# EAGLE design HeepTeensyBoard (EAGLE 7.3.0)
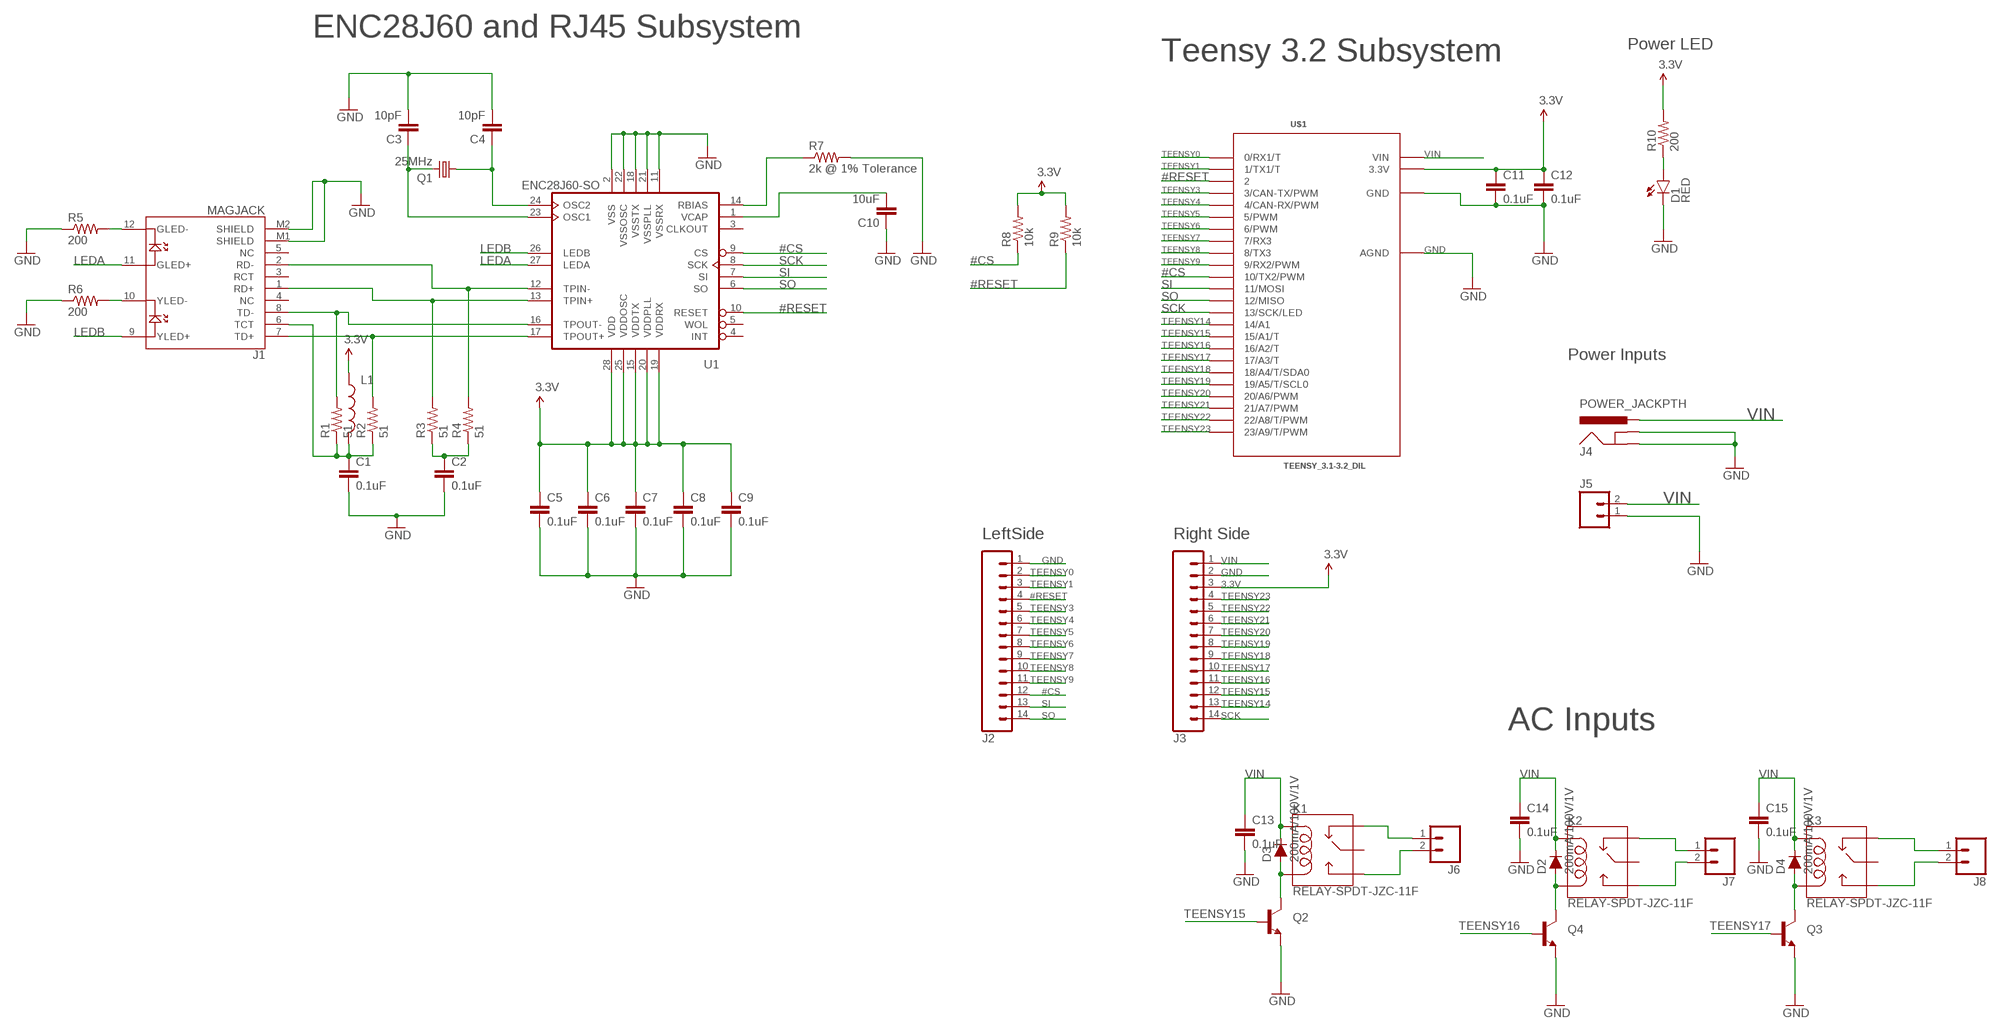
[diagram p0: schematic, sheet 1]

## Parts
C1  0.1uF  CAP0603-CAP  [0603-CAP]
C2  0.1uF  CAP0603-CAP  [0603-CAP]
C3  10pF  CAP0603-CAP  [0603-CAP]
C4  10pF  CAP0603-CAP  [0603-CAP]
C5  0.1uF  CAP0603-CAP  [0603-CAP]
C6  0.1uF  CAP0603-CAP  [0603-CAP]
C7  0.1uF  CAP0603-CAP  [0603-CAP]
C8  0.1uF  CAP0603-CAP  [0603-CAP]
C9  0.1uF  CAP0603-CAP  [0603-CAP]
C10  10uF  CAP0603-CAP  [0603-CAP]
C11  0.1uF  CAP0603-CAP  [0603-CAP]
C12  0.1uF  CAP0603-CAP  [0603-CAP]
C13  0.1uF  CAP0603-CAP  [0603-CAP]
C14  0.1uF  CAP0603-CAP  [0603-CAP]
C15  0.1uF  CAP0603-CAP  [0603-CAP]
D1  RED  LED-RED0603  [LED-0603]
D2  200mA/100V/1V  DIODE-1N4148  [DIODE-1N4148]
D3  200mA/100V/1V  DIODE-1N4148  [DIODE-1N4148]
D4  200mA/100V/1V  DIODE-1N4148  [DIODE-1N4148]
J1  MAGJACK  [MAGJACK]
J2  M14  [1X14]
J3  M14  [1X14]
J4  POWER_JACKPTH  [POWER_JACK_PTH]
J5  M02PTH  [1X02]
J6  M025MM  [SCREWTERMINAL-5MM-2]
J7  M025MM  [SCREWTERMINAL-5MM-2]
J8  M025MM  [SCREWTERMINAL-5MM-2]
K1  RELAY-SPDT-JZC-11F  [RELAY-JZC]
K2  RELAY-SPDT-JZC-11F  [RELAY-JZC]
K3  RELAY-SPDT-JZC-11F  [RELAY-JZC]
L1  INDUCTOR0603  [0603]
Q1  25MHz  CRYSTALSM49  [SM49]
Q2  TRANSISTOR_NPNSOT23-3  [SOT23-3]
Q3  TRANSISTOR_NPNSOT23-3  [SOT23-3]
Q4  TRANSISTOR_NPNSOT23-3  [SOT23-3]
R1  51  RESISTOR0603  [0603-RES]
R2  51  RESISTOR0603  [0603-RES]
R3  51  RESISTOR0603  [0603-RES]
R4  51  RESISTOR0603  [0603-RES]
R5  200  RESISTOR0603  [0603-RES]
R6  200  RESISTOR0603  [0603-RES]
R7  2k @ 1% Tolerance  RESISTOR0603-RES  [0603-RES]
R8  10k  RESISTOR0603-RES  [0603-RES]
R9  10k  RESISTOR0603-RES  [0603-RES]
R10  200  RESISTOR0603-RES  [0603-RES]
U1  ENC28J60-SO  [SO28W]
U$1  TEENSY_3.1-3.2_DIL  [TEENSY_3.0-3.2&LC_DIL]

## Nets
3.3V: C5.1 C6.1 C7.1 C8.1 C9.1 C11.1 C12.1 J3.3 L1.1 R8.2 R9.2 R10.2 U1.15(VDDTX) U1.19(VDDRX) U1.20(VDDPLL) U1.25(VDDOSC) U1.28(VDD) U$1.3.3V
#CS: J2.12 R8.1 U1.9(CS) U$1.10(10/TX2/PWM)
#RESET: J2.4 R9.1 U1.10(RESET) U$1.2
GND: C1.2 C2.2 C3.2 C4.2 C5.2 C6.2 C7.2 C8.2 C9.2 C10.1 C11.2 C12.2 C13.2 C14.2 C15.2 D1.C J1.M1(SHIELD) J1.M2(SHIELD) J2.1 J3.2 J4.GND J4.GNDBREAK J5.1 Q2.2(E) Q3.2(E) Q4.2(E) R5.1 R6.1 R7.2 U1.2(VSS) U1.11(VSSRX) U1.18(VSSTX) U1.21(VSSPLL) U1.22(VSSOSC) U$1.AGND U$1.GND
LEDA: J1.11(GLED+) U1.27(LEDA)
LEDB: J1.9(YLED+) U1.26(LEDB)
N$1: J1.1(RD+) R3.2 U1.13(TPIN+)
N$2: J1.2(RD-) R4.2 U1.12(TPIN-)
N$3: J1.8(TD-) R1.2 U1.16(TPOUT-)
N$4: J1.7(TD+) R2.2 U1.17(TPOUT+)
N$5: C2.1 R3.1 R4.1
N$6: J1.10(YLED-) R6.2
N$7: C1.1 J1.6(TCT) L1.2 R1.1 R2.1
N$8: D1.A R10.1
N$9: D3.A K1.1(COIL2) Q2.3(C)
N$10: J1.12(GLED-) R5.2
N$11: D2.A K2.1(COIL2) Q4.3(C)
N$12: C3.1 Q1.2 U1.23(OSC1)
N$13: C4.1 Q1.1 U1.24(OSC2)
N$14: D4.A K3.1(COIL2) Q3.3(C)
N$15: R7.1 U1.14(RBIAS)
N$16: J6.1 K1.2(NC)
N$17: C10.2 U1.1(VCAP)
N$18: J6.2 K1.3(NO)
N$19: J7.1 K2.2(NC)
N$20: J7.2 K2.3(NO)
N$21: J8.1 K3.2(NC)
N$22: J8.2 K3.3(NO)
SCK: J3.14 U1.8(SCK) U$1.13(13/SCK/LED)
SI: J2.13 U1.7(SI) U$1.11(11/MOSI)
SO: J2.14 U1.6(SO) U$1.12(12/MISO)
TEENSY0: J2.2 U$1.0(0/RX1/T)
TEENSY1: J2.3 U$1.1(1/TX1/T)
TEENSY3: J2.5 U$1.3(3/CAN-TX/PWM)
TEENSY4: J2.6 U$1.4(4/CAN-RX/PWM)
TEENSY5: J2.7 U$1.5(5/PWM)
TEENSY6: J2.8 U$1.6(6/PWM)
TEENSY7: J2.9 U$1.7(7/RX3)
TEENSY8: J2.10 U$1.8(8/TX3)
TEENSY9: J2.11 U$1.9(9/RX2/PWM)
TEENSY14: J3.13 U$1.14/A0(14/A1)
TEENSY15: J3.12 Q2.1(B) U$1.15/A1(15/A1/T)
TEENSY16: J3.11 Q4.1(B) U$1.16/A2(16/A2/T)
TEENSY17: J3.10 Q3.1(B) U$1.17/A3(17/A3/T)
TEENSY18: J3.9 U$1.18/A4(18/A4/T/SDA0)
TEENSY19: J3.8 U$1.19/A5(19/A5/T/SCL0)
TEENSY20: J3.7 U$1.20/A6(20/A6/PWM)
TEENSY21: J3.6 U$1.21/A7(21/A7/PWM)
TEENSY22: J3.5 U$1.22/A8(22/A8/T/PWM)
TEENSY23: J3.4 U$1.23/A9(23/A9/T/PWM)
VIN: C13.1 C14.1 C15.1 D2.C D3.C D4.C J3.1 J4.PWR J5.2 K1.5(COIL1) K2.5(COIL1) K3.5(COIL1) U$1.VIN
Unconnected: J1.3(RCT) J1.4(NC) J1.5(NC) K1.4(MAIN) K2.4(MAIN) K3.4(MAIN) U1.3(CLKOUT) U1.4(INT) U1.5(WOL)

## Notes on the sheet
- ENC28J60 and RJ45 Subsystem
- Power LED
- Teensy 3.2 Subsystem
- Power Inputs
- LeftSide | Right Side
- AC Inputs

## Library data of the parts
C1 C2 C5-C9 C11-C15 = SparkFun-Capacitors:CAP: Capacitor Standard 0603 ceramic capacitor, and 0.1" leaded capacitor.
C3 C4 C10 = SparkFun-Passives:CAP: Capacitor Standard 0603 ceramic capacitor, and 0.1" leaded capacitor.
D1 = SparkFun-LED:LED-RED: Assorted Red LEDs LilyPad 1206- DIO-09912 1206- DIO-00809 0603- DIO-00819 "SMART" means more efficient and expensive; PROD_ID: DIO-00819
D2-D4 = SparkFun-DiscreteSemi:DIODE: Diode These are standard reverse protection diodes and small signal diodes. SparkFun Products: SparkFun SparkPunk Sound Kit <https://www.sparkfun.com/products/11177> SparkFun ESP8266 Thing <https://www.sparkfun.com/products/13231>; PROD_ID: DIO-08378
J1 = SparkFun-Connectors:MAGJACK: MAGJACK: RJ-45 with LEDs This is a single port, RJ45 ethernet jacks with built in transformer (magnetics), status LEDs, and shielding. Here is the connector we sell at SparkFun: RJ45 Ethernet MagJack-Compatible <https://www.sparkfun.com/products/8534> (PRT-08534) Datasheet <http://www.sparkfun.com/datasheets/Prototyping/MagJack.pdf> It is used on this SparkFun product: SparkFun RJ45 MagJack Breakout <https://www.sparkfun.com/products/13021> (BOB-13021); PROD_ID: CONN-09556; SF_ID: PRT-08534
J2 J3 = SparkFun-Connectors:M14: Header 14 Standard 14-pin 0.1" header. Use with straight break away headers (SKU : PRT-00116), right angle break away headers (PRT-00553), swiss pins (PRT-00743), machine pins (PRT-00117), and female headers (PRT-00115).
J4 = SparkFun-Connectors:POWER_JACK: Power Jack This is the standard 5.5mm barrel jack for power. The PTH is the most common, proven, reliable, footprint. The Slot footprint only works if the mill layer is transmitted to the PCB fab house so be warned. Mating wall wart : TOL-00298 (and others); PROD_ID: CONN-08197
J5 = SparkFun-Connectors:M02: Standard 2-pin 0.1" header. Use with - straight break away headers ( PRT-00116) - right angle break away headers (PRT-00553) - swiss pins (PRT-00743) - machine pins (PRT-00117) - female headers (PRT-00115) Molex polarized connector foot print use with: PRT-08233 with associated crimp pins and housings. 2.54_SCREWTERM for use with PRT-10571. 3.5mm Screw Terminal footprints for PRT-08084 5mm Screw Terminal footprints for use with PRT-08432
J6-J8 = SparkFun-Connectors:M02: Standard 2-pin 0.1" header. Use with - straight break away headers ( PRT-00116) - right angle break away headers (PRT-00553) - swiss pins (PRT-00743) - machine pins (PRT-00117) - female headers (PRT-00115) Molex polarized connector foot print use with: PRT-08233 with associated crimp pins and housings. 2.54_SCREWTERM for use with PRT-10571. 3.5mm Screw Terminal footprints for PRT-08084 5mm Screw Terminal footprints for use with PRT-08432; STOREFRONT_ID: PRT-08432
K1-K3 = SparkFun-Electromechanical:RELAY-SPDT: SPDT Electromechanical Relay Single-pole, double-throw sealed relays. When current is applied to the coil, it throws a simple changeover switch, terminating the connection from the NC contact to ground and closing the NO contact. Use them to switch high voltage/high current devices. SparkFun Products JQX-15F: Relay SPDT Sealed - 20A <https://www.sparkfun.com/products/10924> (COM-10924) JZC-11F: Relay SPDT Sealed <https://www.sparkfun.com/products/100> (COM-00100); PROD_ID: COMP-09533; SF_SKU: COM-00100
L1 = SparkFun-Passives:INDUCTOR: Inductors Basic Inductor/Choke - 0603 and 1206. Footprints are not proven and vary greatly between part numbers. INDUCTOR POWER 3.3UH 4.0A SMD 0.197" L x 0.197" W x 0.177" H (5.00mm x 5.00mm x 4.50mm)
Q1 = adafruit:CRYSTAL: CRYSTAL; OC_FARNELL: unknown; OC_NEWARK: unknown
Q2-Q4 = SparkFun-DiscreteSemi:TRANSISTOR_NPN: Generic NPN BJT MMBT2222A - TRANS-08049 (SOT-23, 1A 40V) MPSA42 - TRANS-09116 (SOT-23, 500mA 300V) MMBT5088LT1G - TRANS-11160 (SOT-23, 50 mA 30V) BC547 - COM-08928 <http://www.sparkfun.com/products/8928> (TO-92 45V 100mA) (1.Collector 2.Base 3.Emitter) 2N3904 - COM-00521 <http://www.sparkfun.com/products/521> (TO-92 40V 200mA) (1.Emitter 2.Base 3.Collector) P2N2222A - COM-12852 <http://www.sparkfun.com/products/12852> (TO-92 40V 600mA) (1.Collector 2.Base 3.Emitter); PROD_ID: TRANS-08049
R1-R6 = SparkFun-Resistors:RESISTOR: Resistor Basic schematic elements and footprints for 0603, 1206, and PTH resistors.
R7-R10 = SparkFun-Passives:RESISTOR: Resistor Basic schematic elements and footprints for 0603, 1206, and PTH resistors.
U1 = microchip-enc28j60:ENC28J60-*: Microchip 10Mbit Eth. contoller with SPI interface
U$1 = Teensy_3_and_LC_Series_Boards_v1.4:TEENSY_3.1-3.2_DIL: Teensy 3.1 or 3.2 in a DIL Layout.

## Board
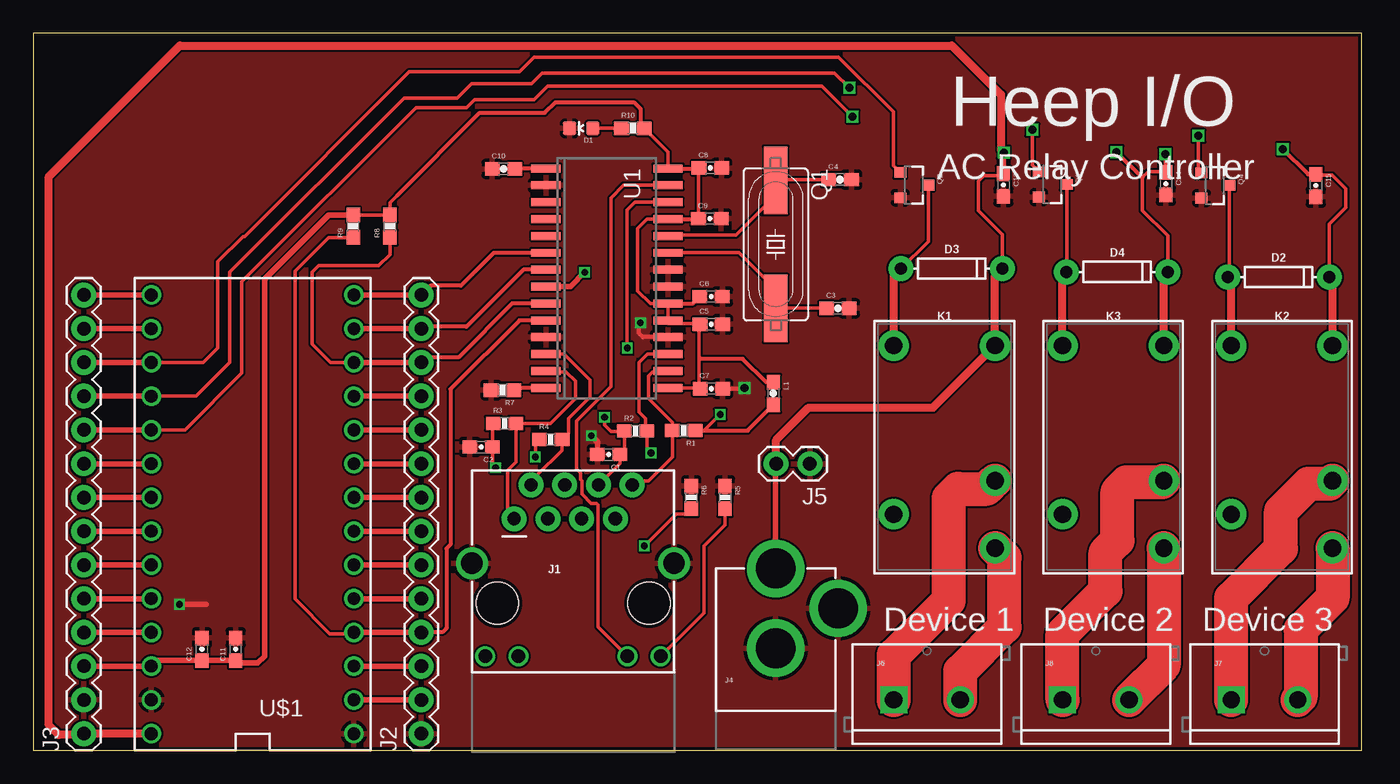
[diagram p1: board, top side]
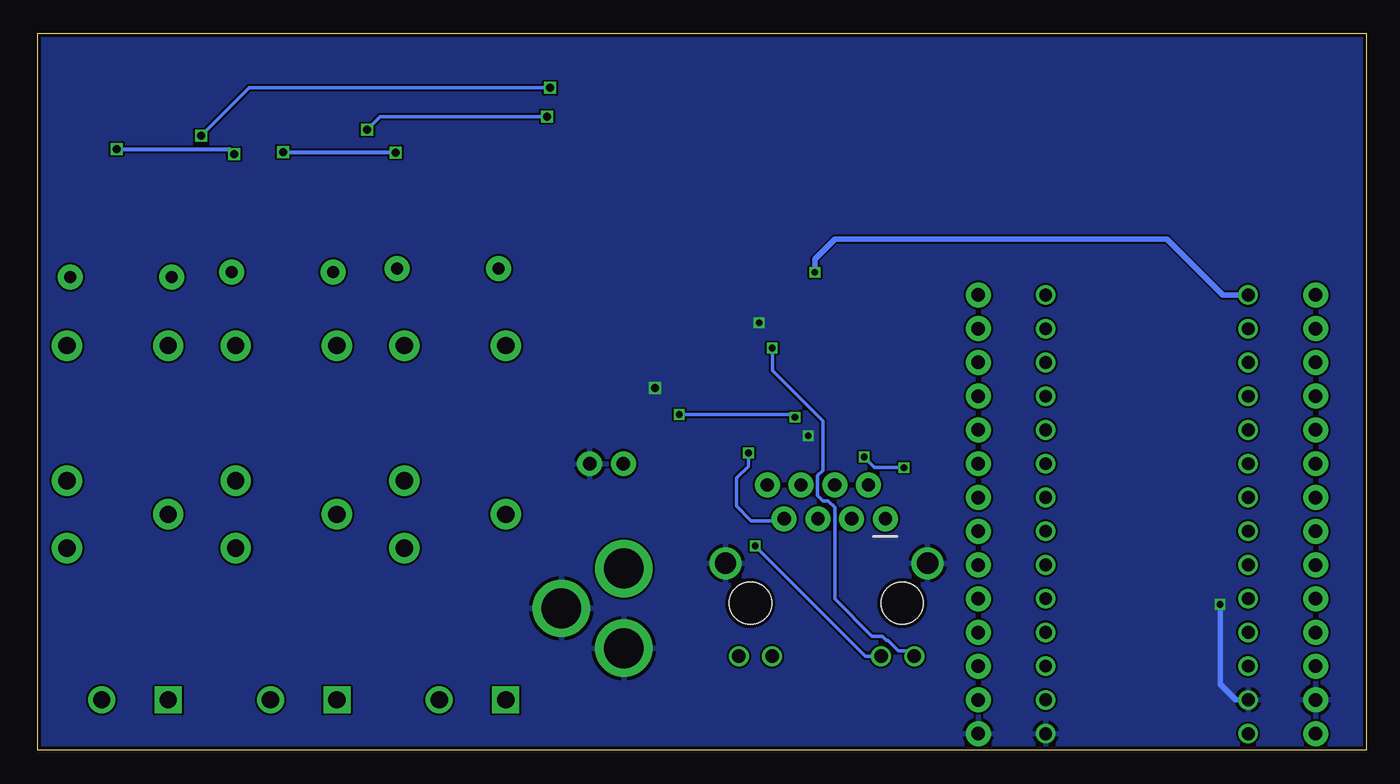
[diagram p2: board, bottom side, seen from below]

Size 100 x 54 mm. Coordinates in mm from the lower left corner, seen from the top.
Outline: 0,0 100,0 100,54 0,54 0,0
Copper layers (1*16): Top 0.035mm / dielectric 1.5mm / Bottom 0.035mm
Design rules "SeeedStudio_2layer_DRU_no_angle_20140221": minimum track width 6mil, minimum drill 12mil, track to track 6mil, track to pad 6mil, pad to pad 6mil, via to via 6mil, smd to smd 0mil, copper to edge 10mil, drill to drill 10mil, minimum pad ring 10mil, minimum via ring 6mil, stop-mask expansion 2mil, vias tented up to drill 100mil, thermal gap 10mil

### Footprints (pad centres in the part's own frame; a part is rotated, then mirrored left to right if it is on the bottom)
0603-CAP = smd 1.1 x 1: 1 -0.85,0; 2 0.85,0
LED-0603 = smd 1 x 1: A 0,-0.877; C 0,0.877
DIODE-1N4148 = drill 0.9 pad 1.88: A -3.81,0; C 3.81,0
MAGJACK = drill 1 pad 1.88: 1 3.175,17.445; 2 4.445,19.985; 3 5.715,17.445; 4 6.985,19.985; 5 8.255,17.445; 6 9.525,19.985; 7 10.795,17.445; 8 12.065,19.985 | drill 1 pad 1.27: 9 1,7.1; 10 3.5,7.1; 11 11.7,7.1; 12 14.2,7.1 | drill 1.6 pad 2.184: M1 0,14.1; M2 15.2,14.1 | hole 3.2: 1.905,11.095; 13.335,11.095
1X14 = drill 1.016 pad 1.88: 1 0,0; 2 2.54,0; 3 5.08,0; 4 7.62,0; 5 10.16,0; 6 12.7,0; 7 15.24,0; 8 17.78,0; 9 20.32,0; 10 22.86,0; 11 25.4,0; 12 27.94,0; 13 30.48,0; 14 33.02,0
POWER_JACK_PTH = drill 2.997 pad 4.318: GND 0,7.7; GNDBREAK 4.7,10.7; PWR 0,13.7
1X02 = drill 1.016 pad 1.88: 1 0,0; 2 2.54,0
SCREWTERMINAL-5MM-2 = drill 1.3 pad 2.032 square: 1 0,0 | drill 1.3 pad 2.032: 2 5,0
RELAY-JZC = drill 1.3 pad 2.286: 1 3.81,-8.89; 2 -3.81,1.27; 3 -3.81,6.35; 4 3.81,3.81; 5 -3.81,-8.89
0603 = smd 1.1 x 1: 1 -0.85,0; 2 0.85,0
SM49 = smd 5.08 x 1.778: 1 -4.826,0; 2 4.826,0
SOT23-3 = smd 0.8 x 0.9: 1 -0.95,-1; 2 0.95,-1; 3 0,1.1
0603-RES = smd 1.1 x 1: 1 -0.85,0; 2 0.85,0
SO28W = smd 0.6 x 2.2: 1 -8.255,-4.6; 2 -6.985,-4.6; 3 -5.715,-4.6; 4 -4.445,-4.6; 5 -3.175,-4.6; 6 -1.905,-4.6; 7 -0.635,-4.6; 8 0.635,-4.6; 9 1.905,-4.6; 10 3.175,-4.6; 11 4.445,-4.6; 12 5.715,-4.6; 13 6.985,-4.6; 14 8.255,-4.6; 15 8.255,4.6; 16 6.985,4.6; 17 5.715,4.6; 18 4.445,4.6; 19 3.175,4.6; 20 1.905,4.6; 21 0.635,4.6; 22 -0.635,4.6; 23 -1.905,4.6; 24 -3.175,4.6; 25 -4.445,4.6; 26 -5.715,4.6; 27 -6.985,4.6; 28 -8.255,4.6
TEENSY_3.0-3.2&LC_DIL = drill 0.965: 0 -7.62,13.97; 1 -7.62,11.43; 2 -7.62,8.89; 3 -7.62,6.35; 3.3V 7.62,11.43; 4 -7.62,3.81; 5 -7.62,1.27; 6 -7.62,-1.27; 7 -7.62,-3.81; 8 -7.62,-6.35; 9 -7.62,-8.89; 10 -7.62,-11.43; 11 -7.62,-13.97; 12 -7.62,-16.51; 13 7.62,-16.51; 14/A0 7.62,-13.97; 15/A1 7.62,-11.43; 16/A2 7.62,-8.89; 17/A3 7.62,-6.35; 18/A4 7.62,-3.81; 19/A5 7.62,-1.27; 20/A6 7.62,1.27; 21/A7 7.62,3.81; 22/A8 7.62,6.35; 23/A9 7.62,8.89; AGND 7.62,13.97; GND -7.62,16.51; VIN 7.62,16.51

### Placement (x,y rotation side)
C1  43.31,22.28 180 top
C2  33.71,22.85 180 top
C3  60.56,33.29 0 top
C4  60.73,42.98 0 top
C5  51.03,32.09 0 top
C6  51.02,34.17 0 top
C7  51.04,27.24 0 top
C8  50.96,43.86 0 top
C9  50.92,40.04 0 top
C10  35.39,43.78 0 top
C11  15.24,7.62 90 top
C12  12.7,7.62 90 top
C13  73.02,42.58 270 top
C14  85.25,42.67 270 top
C15  96.53,42.53 270 top
D1  41.24,46.84 90 top
D2  93.72,35.65 0 top
D3  69.12,36.28 0 top
D4  81.57,36.03 0 top
J1  33.02,0 0 top
J2  29.21,1.27 90 top
J3  3.81,1.27 90 top
J4  55.88,0 0 top
J5  58.45,21.59 180 top
J6  64.77,3.81 0 top
J7  90.17,3.81 0 top
J8  77.47,3.81 0 top
K1  68.58,21.59 180 top
K2  93.98,21.59 180 top
K3  81.28,21.59 180 top
L1  55.71,26.88 270 top
Q1  55.88,38.1 270 top
Q2  66.26,42.56 270 top
Q3  76.69,42.61 270 top
Q4  88.92,42.53 270 top
R1  48.96,24.09 180 top
R2  45.34,24.05 0 top
R3  35.48,24.62 0 top
R4  38.95,23.41 0 top
R5  52.07,19.05 270 top
R6  49.53,19.05 270 top
R7  35.31,27.13 180 top
R8  26.85,39.47 90 top
R9  24.09,39.47 90 top
R10  45.13,46.84 0 top
U1  43.18,35.56 270 top
U$1  16.51,17.78 180 top

### Tracks (layer width: path | path; a pad name or v marks a point on that pad's centre or on a via)
3.3V
  Top 0.254: U1.15 50.12,27.3 | 50.12,27.3 C7.1 | U1.19 U1.20 46.45,33.66 45.5,34.6 45.5,39.3 46.2,40 U1.25 | 50.12,27.3 50.12,29.62 50.12,32.1 C5.1 | C9.1 50.07,43.82 C8.1 | U1.28 47.78,45.04 R10.2 | 27.39,41.79 26.85,41.25 R8.2 R9.2
  Top 0.305: U1.28 50.11,43.81 C8.1 | U1.25 50.07,40.01 C9.1 | C5.1 47.78,32.16 U1.19 | U1.20 49.66,33.66 C6.1 | 27.39,41.79 33.6,48 38.5,48 39.3,48.8 45.2,48.8 45.7,48.3 45.7,47.12 R10.2 | L1.1 55.15,27.73 53.39,29.49 50.26,29.49 50.12,29.62
  Top 0.406: R9.2 22.22,40.32 17.4,35.5 17.4,7.1 16.9,6.6 15.41,6.6 C11.1 C12.1 9.31,6.77 U$1.3.3V J3.3
#CS
  Top 0.254: U$1.10 22.39,29.21 21,30.6 21,36 21.5,36.5 26,36.5 26.85,37.35 R8.1
  Top 0.305: U1.9 36.05,33.66 32,29.6 29.6,29.6 J2.12
  Top 0.406: U$1.10 J2.12
#RESET
  Top 0.254: R9.1 22.22,38.62 19.7,36.1 19.7,11.4 22.3,8.8 24.04,8.8 U$1.2
  Top 0.305: U1.10 36.59,32.38 31.4,27.2 31.4,15.5 31.1,15.2 31.1,9.2 30.8,8.9 J2.4
  Top 0.406: U$1.2 J2.4
  Top 0.61: U$1.2
GND  (via drill 0.5, 0.6)
  Top 0.305: U1.18 45.88,31.11 45.6,31.4 45.6,32.1 v45.7,32.2 | C7.2 53.46,27.24 v53.52,27.3
  Top 0.406: C1.2 42.46,23.24 v42,23.7 | v11,11 13,11
  Bottom 0.305: v45.7,32.2 45.7,32.4 45.6,32.5 | v53.52,27.3 53.68,27.3 53.81,27.17
  Bottom 0.406: v42,23.7 42,23.9 | U$1.AGND 9.81,3.81 11,5 v11,11
  pour Top: -9.4,87.6 105.7,87.6 105.7,-11.2 -9.8,-11.2 -9.8,87.3 -9.8,87.6 -9.5,87.6
  pour Bottom: -11.9,92.9 110.5,92.9 110.5,-17 -11.9,-17
LEDA
  Top 0.254: U1.27 44.45,42.55 43.5,41.6 43.5,27.4 40.9,24.8 40.9,21.2 41.2,20.9 41.2,20.4 41.3,20.3 41.3,19.3 42,18.6 42.4,18.6 42.5,18.5 42.5,9.32 J1.11
LEDB  (via drill 0.5)
  Top 0.254: U1.26 45.27,41.27 44.7,40.7 v44.7,30.3
  Bottom 0.254: v44.7,30.3 44.7,28.6 40.9,24.8 40.9,21.1 41.3,20.7 41.3,19.2 40.9,18.8 40.5,18.8 40,18.3 40,11.4 37.2,8.6 36.4,8.6 36.1,8.3 36,8.3 35.2,7.5 34.42,7.5 J1.9
N$1
  Top 0.254: U1.13 38.66,28.5 40.1,28.5 40.8,27.8 40.8,26.5 38.92,24.62 R3.2 36.33,21.73 35.7,21.1 35.7,17.94 J1.1
N$2
  Top 0.254: U1.12 39.95,29.84 41.9,27.9 41.9,26.6 40.3,25 40.3,23.91 R4.2 39.8,22.6 37.9,20.7 37.9,20.42 J1.2
N$3
  Top 0.254: U1.16 47.7,28.5 46.6,28.5 46.3,28.2 46.3,26.5 48.11,24.69 R1.2 48.11,22.11 46.3,20.3 45.4,20.3 J1.8
N$4  (via drill 0.5)
  Top 0.254: U1.17 46.24,29.84 45.6,29.2 45.6,25.5 46.1,25 46.1,24.14 R2.2 46.19,22.71 v46.5,22.4
  Bottom 0.254: v46.5,22.4 46.5,21.4 47.4,20.5 47.4,18.4 46.3,17.3 43.96,17.3 J1.7
N$5  (via drill 0.5)
  Top 0.254: v34.8,21.3 34.56,21.54 C2.1 34.56,24.55 R3.1 | v37.8,22.1 37.8,23.11 R4.1
  Bottom 0.254: v34.8,21.3 37,21.3 v37.8,22.1
N$6  (via drill 0.5)
  Top 0.254: v46,15.4 48.4,17.8 49.13,17.8 R6.2
  Bottom 0.254: J1.10 37.7,7.1 v46,15.4
N$7  (via drill 0.5)
  Top 0.254: J1.6 44.16,21.6 C1.1 44.49,22.68 R2.1 44.44,24 43.5,24 43,24.5 v43,25.1 | R1.1 50.49,24.09 v51.7,25.3
  Top 0.305: 50.49,24.09 53.77,24.09 L1.2
  Bottom 0.254: v51.7,25.3 43.2,25.3 v43,25.1
N$8
  Top 0.254: R10.1 D1.A
N$9
  Top 0.254: Q2.3 67.36,38.33 D3.A
  Top 0.61: K1.1 64.77,35.74 D3.A
N$10
  Top 0.254: R5.2 52.07,16.97 50.5,15.4 50.5,10.38 J1.12
N$11
  Top 0.254: Q4.3 90.02,35.76 D2.A
  Top 0.61: K2.1 90.17,35.39 D2.A
N$12
  Top 0.254: C3.1 55.9,33.29 Q1.2 55.88,34.72 53.1,37.5 47.81,37.5 U1.23
N$13
  Top 0.254: C4.1 55.93,42.98 Q1.1 55.88,41.78 52.9,38.8 47.84,38.8 U1.24
N$14
  Top 0.254: Q3.3 77.79,36.06 D4.A
  Top 0.61: K3.1 77.47,35.74 D4.A
N$15
  Top 0.305: U1.14 36.34,27.3 R7.1
N$16
  Top 2.54: J6.1 64.77,7.17 68.9,11.3 68.9,19 69.6,19.7 71.77,19.7 K1.2
N$17
  Top 0.305: U1.1 36.24,43.81 C10.2
N$18
  Top 2.54: J6.2 69.77,5.97 73.1,9.3 73.1,14.53 K1.3
N$19
  Top 2.54: J7.1 90.17,11.47 93.9,15.2 93.9,18 96,20.1 97.57,20.1 K2.2
N$20
  Top 2.54: K2.3 97.79,11.49 95.4,9.1 95.4,4.04 J7.2
N$21
  Top 2.54: J8.1 77.47,8.77 80.7,12 80.7,14.9 81.6,15.8 81.6,19.5 82.3,20.2 84.97,20.2 K3.2
N$22
  Top 2.54: K3.3 85.09,6.43 J8.2
SCK  (via drill 0.5)
  Top 0.406: U1.8 40.42,34.92 v41.5,36 | J3.14 U$1.13 | U$1.13 9.39,34.29 9.4,34.3 U$1.13
  Bottom 0.406: v41.5,36 41.5,37 40,38.5 15,38.5 10.8,34.3 U$1.13
SI
  Top 0.305: U1.7 36.9,36.2 32.6,31.9 29.36,31.9 J2.13
  Top 0.406: U$1.11 J2.13
SO
  Top 0.305: U1.6 34.66,37.47 32.2,35 29.92,35 J2.14
  Top 0.406: U$1.12 J2.14
TEENSY0
  Top 0.406: U$1.0 J2.2
TEENSY1
  Top 0.406: U$1.1 J2.3
TEENSY3
  Top 0.406: U$1.3 J2.5
TEENSY4
  Top 0.406: U$1.4 J2.6
TEENSY5
  Top 0.406: U$1.5 J2.7
TEENSY6
  Top 0.406: J2.8 U$1.6
TEENSY7
  Top 0.406: U$1.7 J2.9
TEENSY8
  Top 0.406: U$1.8 J2.10
TEENSY9
  Top 0.406: U$1.9 J2.11
TEENSY14
  Top 0.406: U$1.14/A0 J3.13
TEENSY15
  Top 0.254: U$1.15/A1 12.81,29.21 13.9,30.3 13.9,36.8 15.8,38.7 15.9,38.7 28.3,51.1 36.6,51.1 37.7,52.2 60.62,52.2 64.73,48.09 64.73,44.04 Q2.1
  Top 0.406: J3.12 U$1.15/A1
TEENSY16  (via drill 0.6)
  Top 0.254: U$1.16/A2 12.27,26.67 14.8,29.2 14.8,36 27.9,49.1 31.9,49.1 33,50.2 37.5,50.2 38.3,51 60.32,51 v61.43,49.89 | v87.7,46.28 87.7,43.7 Q4.1
  Top 0.406: U$1.16/A2 J3.11
  Bottom 0.254: v61.43,49.89 84.09,49.89 v87.7,46.28
TEENSY17  (via drill 0.6)
  Top 0.254: U$1.17/A3 11.43,24.13 15.7,28.4 15.7,35.3 28.8,48.4 32.6,48.4 33.2,49 37.7,49 38.7,50 59.38,50 v61.66,47.72 | v75.2,46.73 75.2,44.05 Q3.1
  Top 0.406: J3.10 U$1.17/A3
  Bottom 0.254: v61.66,47.72 74.21,47.72 v75.2,46.73
TEENSY18
  Top 0.406: U$1.18/A4 J3.9
TEENSY19
  Top 0.406: J3.8 U$1.19/A5
TEENSY20
  Top 0.406: U$1.20/A6 J3.7
TEENSY21
  Top 0.406: J3.6 U$1.21/A7
TEENSY22
  Top 0.406: J3.5 U$1.22/A8
TEENSY23
  Top 0.406: J3.4 U$1.23/A9
VIN  (via drill 0.6)
  Top 0.254: D3.C 72.93,38.85 71.12,40.66 71.12,42.85 71.55,43.28 72.87,43.28 C13.1 | D2.C 97.53,39.63 98.78,40.88 98.78,42.31 97.77,43.32 96.59,43.32 C15.1 | D4.C 85.38,38.76 83.49,40.65 83.49,43.16 83.92,43.59 85.18,43.59 C14.1
  Top 0.305: C15.1 95.96,43.38 v94.06,45.28 | v85.19,44.91 85.19,43.58 C14.1 | 83.49,43.16 83.42,43.16 v81.53,45.05 | v73.04,45.01 73.04,43.45 C13.1
  Top 0.406: J4.PWR 55.88,21.56 J5.2 | J3.1 U$1.VIN
  Top 0.61: J5.2 55.91,23.37 58.36,25.82 67.73,25.82 K1.5 72.39,35.74 D3.C | K3.5 85.09,35.74 D4.C | K2.5 97.79,35.39 D2.C | U$1.VIN 3.91,1.27 3.82,1.18 1.91,1.18 1.18,1.91 1.18,43.22 11.03,53.07 69.14,53.07 72.83,49.38 72.83,45.22 v73.04,45.01
  Bottom 0.305: v94.06,45.28 85.56,45.28 v85.19,44.91 | v81.53,45.05 73.08,45.05 v73.04,45.01

### Text on the board
tPlace: Heep I/O | AC Relay Controller | Device 1 | Device 2 | Device 3